# Altium project Hardware.PrjPcb
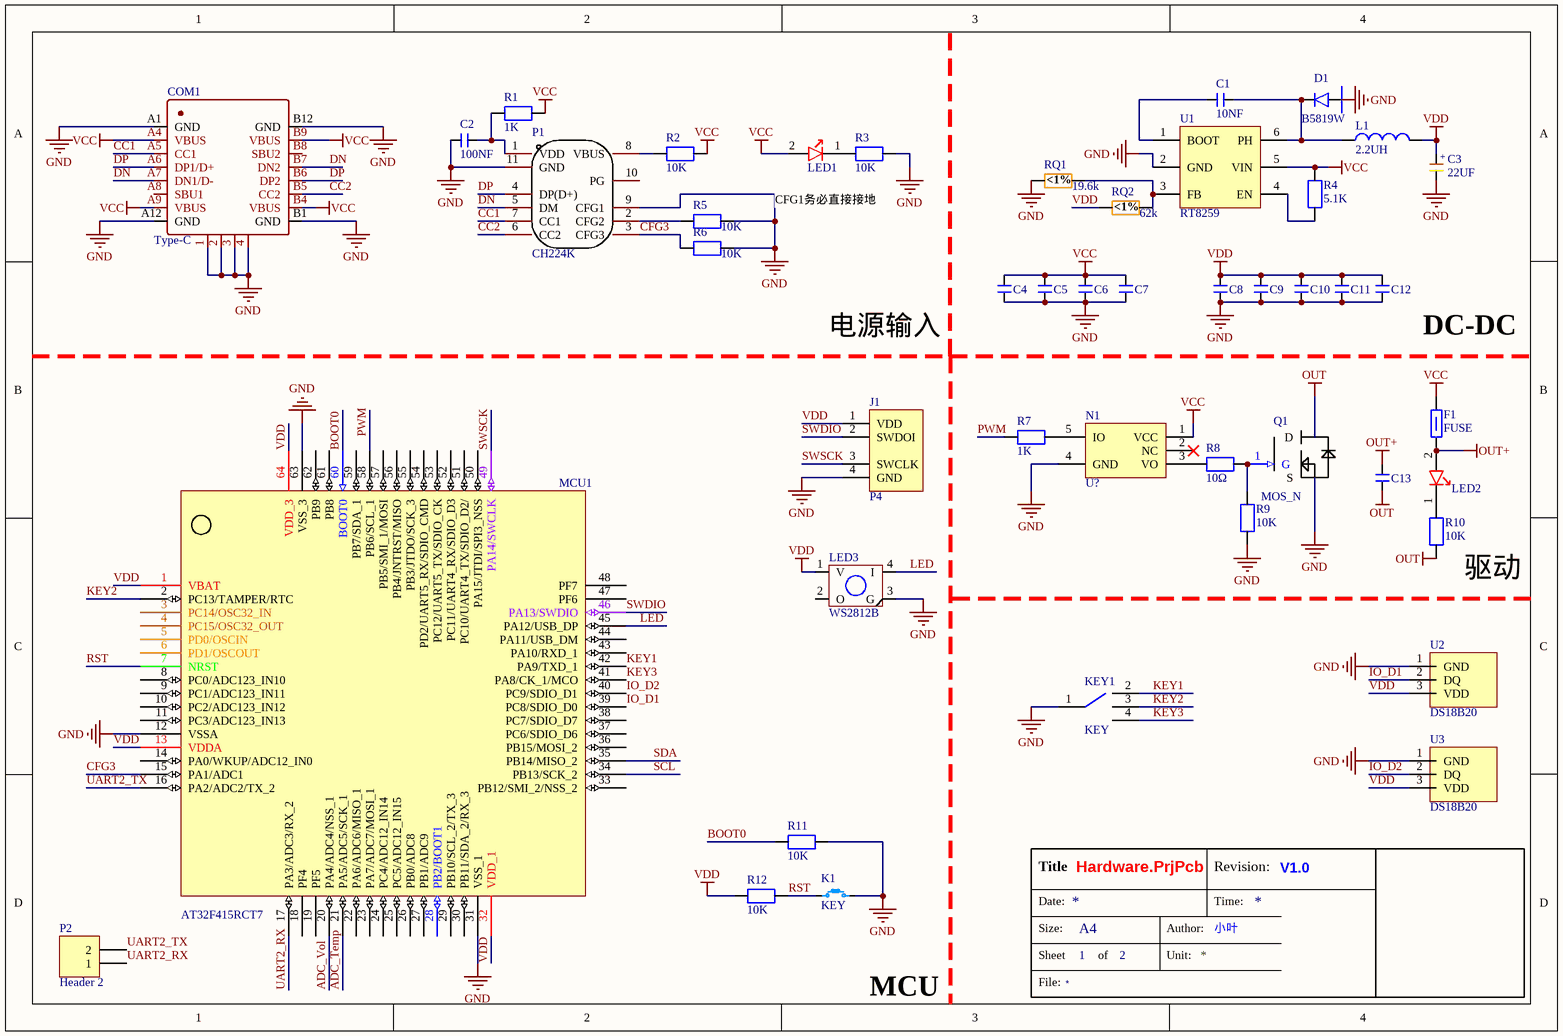
[diagram p0: Sheet.SchDoc]
2 sheets, 67 parts. Net scope: global (net labels, ports and power ports of the same name join across sheets).
Board file: main.PcbDoc
Sheets:
  Sheet.SchDoc
  Sheet2.SchDoc

## Sheet Sheet.SchDoc
size A4; Author: 小叶; Revision: V1.0; SheetNumber: 1; SheetTotal: 2

### Parts
C1  10NF  [CAP_0603]
C2  100NF  [CAP_0603]
C3  22UF  [CAP_3216_A]
C4  22UF  [CAP_1206]  (value not drawn)
C5  100NF  [CAP_0603]  (value not drawn)
C6  100NF  [CAP_0603]  (value not drawn)
C7  100NF  [CAP_0603]  (value not drawn)
C8  100NF  [CAP_0603]  (value not drawn)
C9  100NF  [CAP_0603]  (value not drawn)
C10  100NF  [CAP_0603]  (value not drawn)
C11  100NF  [CAP_0603]  (value not drawn)
C12  100NF  [CAP_0603]  (value not drawn)
C13  100NF  [CAP_0603]  (value not drawn)
COM1  Type-C  [USB-Type-C_16A]
D1  B5819W  [DIODE_SOD123]
F1  FUSE  [FUSE_1206]
J1  P4  [Header 2.54X4]
K1  KEY  [KEY-A]
KEY1  KEY  [KEY-K1-1502SA-LY-K3]
L1  2.2UH  [INDUCTANCE_4*4]
LED1  LED_R/G/B/Y  [LED_0603_R]  (value not drawn)
LED2  LED_R/G/B/Y  [LED_0603_R]  (value not drawn)
LED3  WS2812B  [WS2812B]
MCU1  AT32F415RCT7  [LQFP64P-7]
N1  U?  [SOT23_5]
P1  CH224K  [ESSOP_10]
P2  Header 2  [HDR1X2]
Q1  MOS_N  [TO252_2]
R1  1K  [RESC_0603_2]
R2  10K  [RESC_0603_2]
R3  10K  [RESC_0603_2]
R4  5.1K  [RESC_0603_2]
R5  10K  [RESC_0603_2]
R6  10K  [RESC_0603_2]
R7  1K  [RESC_0603_2]
R8  10Ω  [RESC_0603_2]
R9  10K  [RESC_0603_2]
R10  10K  [RESC_0603_2]
R11  10K  [RESC_0603_2]
R12  10K  [RESC_0603_2]
RQ1  19.6k  [RESC_0603_2]
RQ2  62k  [RESC_0603_2]
U1  RT8259  [SOT-23-6]
U2  DS18B20  [TO_92B]
U3  DS18B20  [TO_92B]

### Nets
GND: C2.2 C3.2 C4.1 C5.2 C6.2 C7.2 C8.2 C9.2 C10.2 C11.2 C12.2 COM1.1 COM1.2 COM1.3 COM1.4 COM1.A1(GND) COM1.A12(GND) COM1.B1(GND) COM1.B12(GND) D1.1(P) J1.4(GND) K1.1 KEY1.1 LED3.3(G) MCU1.12(VSSA) MCU1.31(VSS_1) MCU1.63(VSS_3) N1.4(GND) P1.9(CFG1) P1.11(GND) Q1.2(S) R3.2 R5.2 R6.2 R9.2 R11.2 RQ1.1 U1.2(GND) U2.1(GND) U3.1(GND)
OUT: C13.2 Q1.3(D) R10.2
OUT+: C13.1 F1.1 LED2.2(+)
VCC: C4.2 C5.1 C6.1 C7.1 COM1.A4(VBUS) COM1.A9(VBUS) COM1.B4(VBUS) COM1.B9(VBUS) F1.2 LED1.2(+) N1.1(VCC) R1.2 R2.2 R4.2 U1.5(VIN)
VDD: C3.1 C8.1 C9.1 C10.1 C11.1 C12.1 J1.1(VDD) L1.2 LED3.1(V) MCU1.1(VBAT) MCU1.13(VDDA) MCU1.32(VDD_1) MCU1.64(VDD_3) R12.1 RQ2.1 U2.3(VDD) U3.3(VDD)
ADC_Temp: MCU1.21(PA5/ADC5/SCK_1)
ADC_Vol: MCU1.20(PA4/ADC4/NSS_1)
BOOT0: MCU1.60(BOOT0) R11.1
CC1: COM1.A5(CC1) P1.7(CC1)
CC2: COM1.B5(CC2) P1.6(CC2)
CFG3: MCU1.15(PA1/ADC1) P1.3(CFG3) R6.1
DN: COM1.A7(DN1/D-) COM1.B7(DN2) P1.5(DM)
DP: COM1.A6(DP1/D+) COM1.B6(DP2) P1.4(DP(D+))
IO_D1: MCU1.39(PC8/SDIO_D0) U2.2(DQ)
IO_D2: MCU1.40(PC9/SDIO_D1) U3.2(DQ)
KEY1: KEY1.2 MCU1.42(PA9/TXD_1)
KEY2: KEY1.3 MCU1.2(PC13/TAMPER/RTC)
KEY3: KEY1.4 MCU1.41(PA8/CK_1/MCO)
LED: LED3.4(I) MCU1.45(PA12/USB_DP)
PWM: MCU1.58(PB6/SCL_1) R7.2
RST: K1.2 MCU1.7(NRST) R12.2
SCL: MCU1.34(PB13/SCK_2)
SDA: MCU1.35(PB14/MISO_2)
SWDIO: J1.2(SWDOI) MCU1.46(PA13/SWDIO)
SWSCK: J1.3(SWCLK) MCU1.49(PA14/SWCLK)
UART2_RX: MCU1.17(PA3/ADC3/RX_2) P2.1
UART2_TX: MCU1.16(PA2/ADC2/TX_2) P2.2
NetC1_1: C1.1 D1.2(N) L1.1 U1.6(PH)
NetC1_2: C1.2 U1.1(BOOT)
NetC2_1: C2.1 P1.1(VDD) R1.1
NetLED1_1: LED1.1(-) R3.1
NetLED2_1: LED2.1(-) R10.1
NetN1_3: N1.3(VO) R8.2
NetN1_5: N1.5(IO) R7.1
NetP1_2: P1.2(CFG2) R5.1
NetP1_8: P1.8(VBUS) R2.1
NetQ1_1: Q1.1(G) R8.1 R9.1
NetR4_1: R4.1 U1.4(EN)
NetRQ1_2: RQ1.2 RQ2.2 U1.3(FB)

Not connected (* = marked no-connect by the designer): COM1 A8(SBU1) B8(SBU2); LED3 2(O); MCU1 3(PC14/OSC32_IN) 4(PC15/OSC32_OUT) 5(PD0/OSCIN) 6(PD1/OSCOUT) 8(PC0/ADC123_IN10) 9(PC1/ADC123_IN11) 10(PC2/ADC123_IN12) 11(PC3/ADC123_IN13) 14(PA0/WKUP/ADC12_IN0) 18(PF4) 19(PF5) 22(PA6/ADC6/MISO_1) 23(PA7/ADC7/MOSI_1) 24(PC4/ADC12_IN14) 25(PC5/ADC12_IN15) 26(PB0/ADC8) 27(PB1/ADC9) 28(PB2/BOOT1) 29(PB10/SCL_2/TX_3) 30(PB11/SDA_2/RX_3) 33(PB12/SMI_2/NSS_2) 36(PB15/MOSI_2) 37(PC6/SDIO_D6) 38(PC7/SDIO_D7) 43(PA10/RXD_1) 44(PA11/USB_DM) 47(PF6) 48(PF7) 50(PA15/JTDI/SPI3_NSS) 51(PC10/UART4_TX/SDIO_D2/) 52(PC11/UART4_RX/SDIO_D3) 53(PC12/UART5_TX/SDIO_CK) 54(PD2/UART5_RX/SDIO_CMD) 55(PB3/JTDO/SCK_3) 56(PB4/JNTRST/MISO) 57(PB5/SMI_1/MOSI) 59(PB7/SDA_1) 61(PB8) 62(PB9); N1 2(NC)*; P1 10(PG)

### Notes on the sheet
- CFG1务必直接接地
- 电源输入
- DC-DC
- (near R10) 驱动
- MCU
- Title
- Date:
- Revision:
- Time:
- File:
- Size:
- Sheet
- A4
- of
- Author:
- Unit:
- (in symbol CAP_TA) +
- (in symbol RES_quality) <1%

### Library data of the parts
C1 C2 C4-C13 = CAP: CAP  12~50V
C3 = CAP_TA: CAP  6~12V  钽电容
COM1 = USB-type_c: USB
D1 = Diode-SM: Diode_肖特基/二极管
J1 = SWD: Header
KEY1 = LY-K3
L1 = Inductor: Code_IEC: 1005; Published: 8-Jun-2000; LatestRevisionDate: 29-May-2009; LatestRevisionNote: IPC-7351 Footprint Added.; PackageReference: 0402-A; Publisher: Altium Limited; PackageDescription: Chip Inductor; Code_JEITA: 0402
LED1 LED2 = LED_SMT: LED
LED3 = WS2812B: LED
MCU1 = AT32F415RCT7: MCU
N1 = N531: 栅极控制器，18V
P1 = CH224K: PD\QC
P2 = Header 2: Header, 2-Pin; LatestRevisionDate: 17-Jul-2002; LatestRevisionNote: Re-released for DXP Platform.; Publisher: Altium Limited
Q1 = MOSFET_N: MOS
R1-R12 = RES: RES 贴片
RQ1 RQ2 = RES_quality: RES
U1 = RT8259: DC-DC
U2 U3 = DS18B20: MODE

## Sheet Sheet2.SchDoc
size A4; SheetNumber: 2; SheetTotal: 2
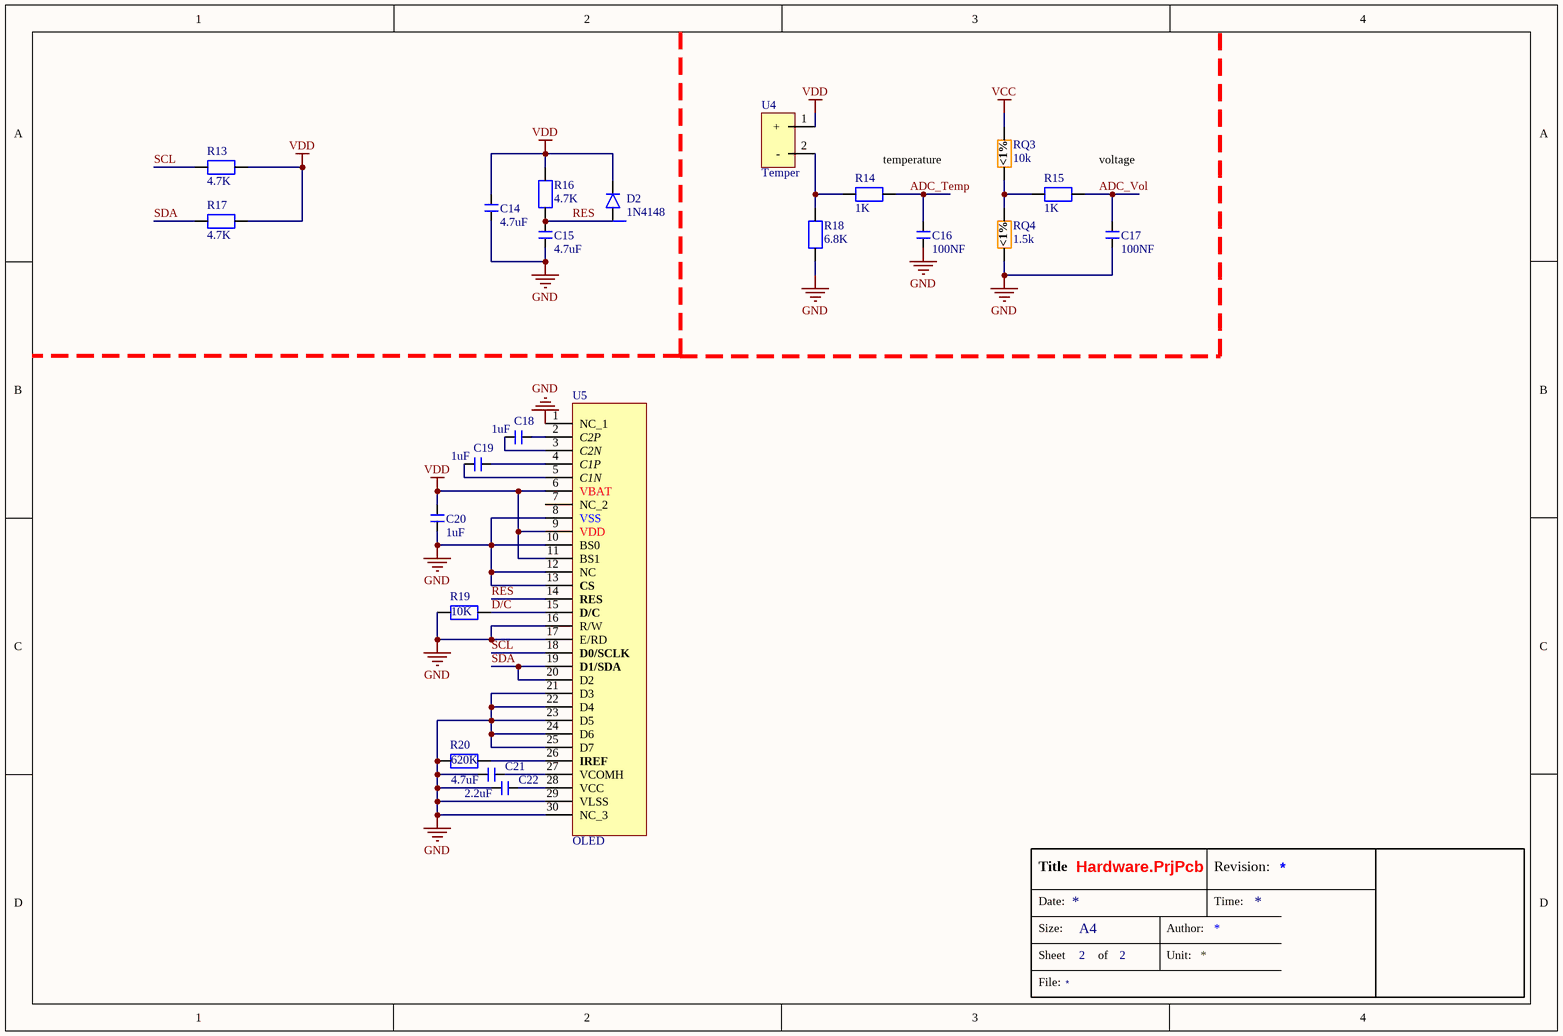
[diagram p1: Sheet2.SchDoc]

### Parts
C14  4.7uF  [CAP_0603]
C15  4.7uF  [CAP_0603]
C16  100NF  [CAP_0603]
C17  100NF  [CAP_0603]
C18  1uF  [CAP_0603]
C19  1uF  [CAP_0603]
C20  1uF  [CAP_0603]
C21  4.7uF  [CAP_0603]
C22  2.2uF  [CAP_0603]
D2  1N4148  [DIODE_SOD123]
R13  4.7K  [RESC_0603_2]
R14  1K  [RESC_0603_2]
R15  1K  [RESC_0603_2]
R16  4.7K  [RESC_0603_2]
R17  4.7K  [RESC_0603_2]
R18  6.8K  [RESC_0603_2]
R19  10K  [RESC_0603_2]
R20  620K  [RESC_0603_2]
RQ3  10k  [RESC_0603_2]
RQ4  1.5k  [RESC_0603_2]
U4  Temper  [RESC_0603_1]
U5  OLED  [OLED_0.96]

### Nets
GND: C14.1 C15.1 C16.1 C17.1 C20.2 C21.2 C22.2 R18.2 R19.2 R20.2 RQ4.1 U5.1(NC_1) U5.8(VSS) U5.10(BS0) U5.12(NC) U5.13(CS) U5.16(R/W) U5.17(E/RD) U5.21(D3) U5.22(D4) U5.23(D5) U5.24(D6) U5.25(D7) U5.29(VLSS) U5.30(NC_3)
VCC: RQ3.2
VDD: C14.2 C20.1 D2.2(N) R13.1 R16.2 R17.1 U4.1(+) U5.6(VBAT) U5.9(VDD) U5.11(BS1)
ADC_Temp: C16.2 R14.2
ADC_Vol: C17.2 R15.2
D/C: R19.1 U5.15(D/C)
RES: C15.2 D2.1(P) R16.1 U5.14(RES)
SCL: R13.2 U5.18(D0/SCLK)
SDA: R17.2 U5.19(D1/SDA) U5.20(D2)
NetC18_1: C18.1 U5.2(C2P)
NetC18_2: C18.2 U5.3(C2N)
NetC19_1: C19.1 U5.4(C1P)
NetC19_2: C19.2 U5.5(C1N)
NetC21_1: C21.1 U5.27(VCOMH)
NetC22_1: C22.1 U5.28(VCC)
NetR14_1: R14.1 R18.1 U4.2(-)
NetR15_1: R15.1 RQ3.1 RQ4.2
NetR20_1: R20.1 U5.26(IREF)

Not connected (* = marked no-connect by the designer): U5 7(NC_2)

### Notes on the sheet
- (near R14) temperature
- (near R15) voltage
- Title
- Date:
- Revision:
- Time:
- File:
- Size:
- Sheet
- A4
- of
- Author:
- Unit:
- (in symbol RES_quality) <1%

### Library data of the parts
C14-C22 = CAP: CAP  12~50V
D2 = Diode-SM: Diode_肖特基/二极管
R13-R20 = RES: RES 贴片
RQ3 RQ4 = RES_quality: RES
U4 = Temper: Mode
U5 = OLED_0.96: SHOW

## Nets that join several sheets
GND: Sheet (40 pins), Sheet2 (25 pins)
VCC: Sheet (15 pins), Sheet2 (RQ3.2)
VDD: Sheet (17 pins), Sheet2 (10 pins)
ADC_Temp: Sheet (MCU1.21), Sheet2 (C16.2 R14.2)
ADC_Vol: Sheet (MCU1.20), Sheet2 (C17.2 R15.2)
SCL: Sheet (MCU1.34), Sheet2 (R13.2 U5.18)
SDA: Sheet (MCU1.35), Sheet2 (R17.2 U5.19 U5.20)